# Altium schematic sheet SheetArduinoNano.SchDoc
size A4
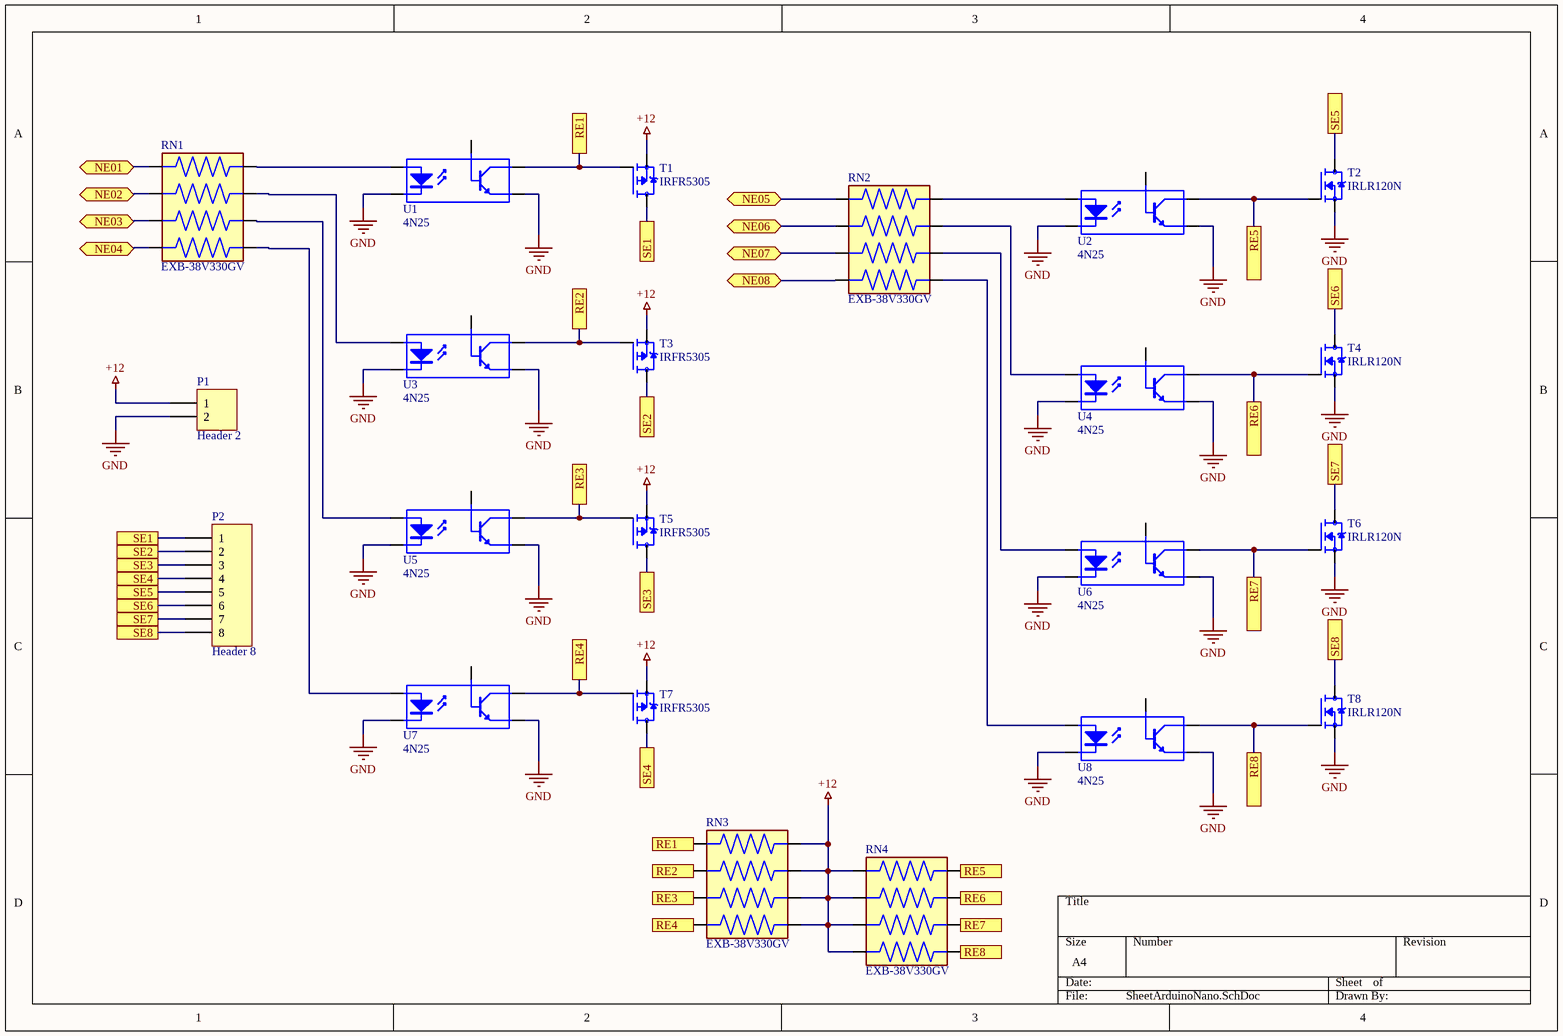
[diagram p0: SheetArduinoNano.SchDoc]

## Parts
P1  Header 2  [HDR1X2]
P2  Header 8  [HDR1X8]
RN1  EXB-38V330GV  [RESCAXS80P320X160X60-8N]
RN2  EXB-38V330GV  [RESCAXS80P320X160X60-8N]
RN3  EXB-38V330GV  [RESCAXS80P320X160X60-8N]
RN4  EXB-38V330GV  [RESCAXS80P320X160X60-8N]
T1  IRFR5305  [D-PAK_TO252AA]
T2  IRLR120N  [DPAK229P990X239-3N]
T3  IRFR5305  [D-PAK_TO252AA]
T4  IRLR120N  [DPAK229P990X239-3N]
T5  IRFR5305  [D-PAK_TO252AA]
T6  IRLR120N  [DPAK229P990X239-3N]
T7  IRFR5305  [D-PAK_TO252AA]
T8  IRLR120N  [DPAK229P990X239-3N]
U1  4N25  [SOP5(6)]
U2  4N25  [SOP5(6)]
U3  4N25  [SOP5(6)]
U4  4N25  [SOP5(6)]
U5  4N25  [SOP5(6)]
U6  4N25  [SOP5(6)]
U7  4N25  [SOP5(6)]
U8  4N25  [SOP5(6)]

## Ports
NE01 (bidir), NE02 (bidir), NE03 (bidir), NE04 (bidir), NE05 (bidir), NE06 (bidir), NE07 (bidir), NE08 (bidir), RE1, RE2, RE3, RE4, RE5, RE6, RE7, RE8, SE1, SE2, SE3, SE4, SE5, SE6, SE7, SE8

## Nets
+12: P1.1 RN3.5 RN3.6 RN3.7 RN3.8 RN4.1 RN4.2 RN4.3 RN4.4 T1.3(S) T3.3(S) T5.3(S) T7.3(S)
GND: P1.2 T2.2(S) T4.2(S) T6.2(S) T8.2(S) U1.3(K) U1.4(E) U2.3(K) U2.4(E) U3.3(K) U3.4(E) U4.3(K) U4.4(E) U5.3(K) U5.4(E) U6.3(K) U6.4(E) U7.3(K) U7.4(E) U8.3(K) U8.4(E)
NE01: RN1.1 ; port NE01
NE02: RN1.2 ; port NE02
NE03: RN1.3 ; port NE03
NE04: RN1.4 ; port NE04
NE05: RN2.1 ; port NE05
NE06: RN2.2 ; port NE06
NE07: RN2.3 ; port NE07
NE08: RN2.4 ; port NE08
RE1: RN3.1 T1.1(G) U1.5(C) ; port RE1
RE2: RN3.2 T3.1(G) U3.5(C) ; port RE2
RE3: RN3.3 T5.1(G) U5.5(C) ; port RE3
RE4: RN3.4 T7.1(G) U7.5(C) ; port RE4
RE5: RN4.8 T2.1(G) U2.5(C) ; port RE5
RE6: RN4.7 T4.1(G) U4.5(C) ; port RE6
RE7: RN4.6 T6.1(G) U6.5(C) ; port RE7
RE8: RN4.5 T8.1(G) U8.5(C) ; port RE8
SE1: P2.1 T1.4(D) ; port SE1
SE2: P2.2 T3.4(D) ; port SE2
SE3: P2.3 T5.4(D) ; port SE3
SE4: P2.4 T7.4(D) ; port SE4
SE5: P2.5 T2.3(D) ; port SE5
SE6: P2.6 T4.3(D) ; port SE6
SE7: P2.7 T6.3(D) ; port SE7
SE8: P2.8 T8.3(D) ; port SE8
NetRN1_5: RN1.5 U7.1(A)
NetRN1_6: RN1.6 U5.1(A)
NetRN1_7: RN1.7 U3.1(A)
NetRN1_8: RN1.8 U1.1(A)
NetRN2_5: RN2.5 U8.1(A)
NetRN2_6: RN2.6 U6.1(A)
NetRN2_7: RN2.7 U4.1(A)
NetRN2_8: RN2.8 U2.1(A)

Not connected (* = marked no-connect by the designer): U1 6(B); U2 6(B); U3 6(B); U4 6(B); U5 6(B); U6 6(B); U7 6(B); U8 6(B)

## Library data of the parts
P1 = Header 2: Header, 2-Pin; LatestRevisionDate: 17-Jul-2002; LatestRevisionNote: Re-released for DXP Platform.; Publisher: Altium Limited
P2 = Header 8: Header, 8-Pin; LatestRevisionDate: 17-Jul-2002; LatestRevisionNote: Re-released for DXP Platform.; Publisher: Altium Limited
RN1-RN4 = EXB-38V330GV: Resistor Array, Chip, 4 elements CONVEX 1206 2%; MF: Panasonic; SnapEDA_Link: https://www.snapeda.com/parts/EXB-38V330GV/Panasonic/view-part/1421932/?ref=snap; Price: None; MP: EXB-38V330GV; Package: 0603 Panasonic; Value: *; Check_prices: https://www.snapeda.com/parts/EXB-38V330GV/Panasonic/view-part/1421932/?ref=eda; Availability: Bad
T1 T3 T5 T7 = IRFR5305: P-Channel 55V 31A _Tc_ 110W _Tc_ Surface Mount D-Pak; MF: Infineon Technologies; Availability: Unavailable; Value: *; Package: TO-252-3 Infineon Technologies; Price: None; SnapEDA_Link: https://www.snapeda.com/parts/IRFR5305/Infineon%20Technologies/view-part/2877715/?ref=snap; MP: IRFR5305
T2 T4 T6 T8 = IRLR120N: N-Channel 100V 10A _Tc_ 48W _Tc_ Surface Mount D-Pak; MF: Infineon Technologies; Price: None; SnapEDA_Link: https://www.snapeda.com/parts/IRLR120N/Infineon%20Technologies/view-part/182771/?ref=snap; Package: TO-252 International Rectifier; Availability: Unavailable; MP: IRLR120N; Value: *
U1-U8 = Optoisolator2: 5 Pin Mini Flat Pack Optocoupler; Published: 24-Mar-1999; LatestRevisionDate: 04-Mar-2005; LatestRevisionNote: PCB Footprint replaced, Sch pins re-numbered.; DatasheetVersion: Apr-2004; PackageReference: SOP5(6); Publisher: Altium Limited; PackageDescription: Small Outline; 6 Leads (1 Absent); Body Width 4.4 mm; Pitch 1.27 mm